# EAGLE design PISO3 (EAGLE 9.6.2)
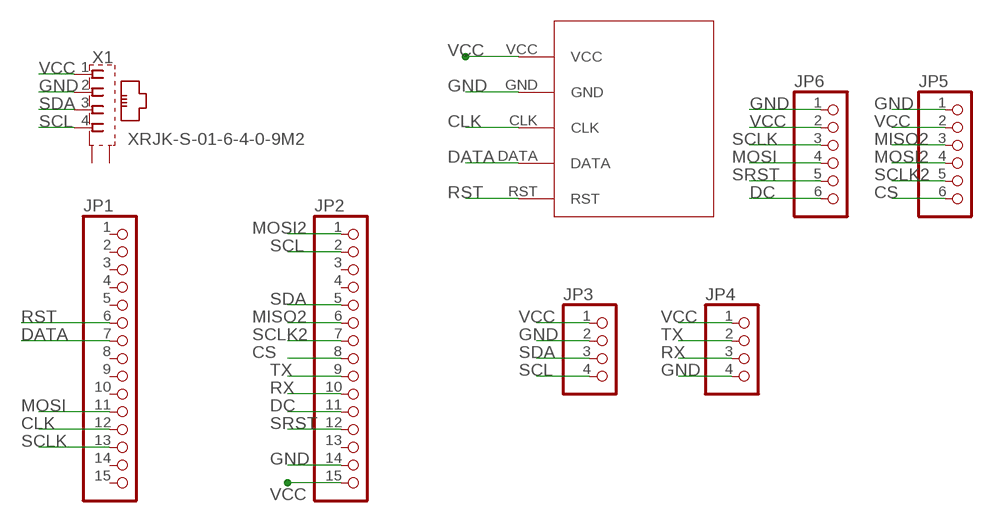
[diagram p0: schematic, sheet 1]

## Parts
JP1  PINHD-1X15  [1X15]
JP2  PINHD-1X15  [1X15]
JP3  PINHD-1X4  [1X04]
JP4  PINHD-1X4  [1X04]
JP5  PINHD-1X6  [1X06]
JP6  PINHD-1X6  [1X06]
U$1  DS1302_MODULE  [DS1307_MODULE]
X1  XRJK-S-01-6-4-0-9M2  [XRJK-S-01-6-4-0-9M2]

## Nets
CLK: JP1.12 U$1.CLK
CS: JP2.8 JP5.6
DATA: JP1.7 U$1.DATA
DC: JP2.11 JP6.6
GND: JP2.14 JP3.2 JP4.4 JP5.1 JP6.1 U$1.GND X1.2
MISO2: JP2.6 JP5.3
MOSI: JP1.11 JP6.4
MOSI2: JP2.1 JP5.4
RST: JP1.6 U$1.RST
RX: JP2.10 JP4.3
SCL: JP2.2 JP3.4 X1.4
SCLK: JP1.13 JP6.3
SCLK2: JP2.7 JP5.5
SDA: JP2.5 JP3.3 X1.3
SRST: JP2.12 JP6.5
TX: JP2.9 JP4.2
VCC: JP2.15 JP3.1 JP4.1 JP5.2 JP6.2 U$1.VCC X1.1
Unconnected: JP1.1 JP1.2 JP1.3 JP1.4 JP1.5 JP1.8 JP1.9 JP1.10 JP1.14 JP1.15 JP2.3 JP2.4 JP2.13 X1.S1(S) X1.S2(S)

## Library data of the parts
JP1 JP2 = pinhead:PINHD-1X15: PIN HEADER
JP3 JP4 = pinhead:PINHD-1X4: PIN HEADER
JP5 JP6 = pinhead:PINHD-1X6: PIN HEADER
U$1 = RTC1302:DS1302_MODULE: DS1302 MODULE
X1 = con-xmultiple:XRJK*4: RJ11 Connector without LED, 6 position, 4 contacts, thrue hole Source: XRJK-S-01-6-4-0-9M2(01).pdf

## Board
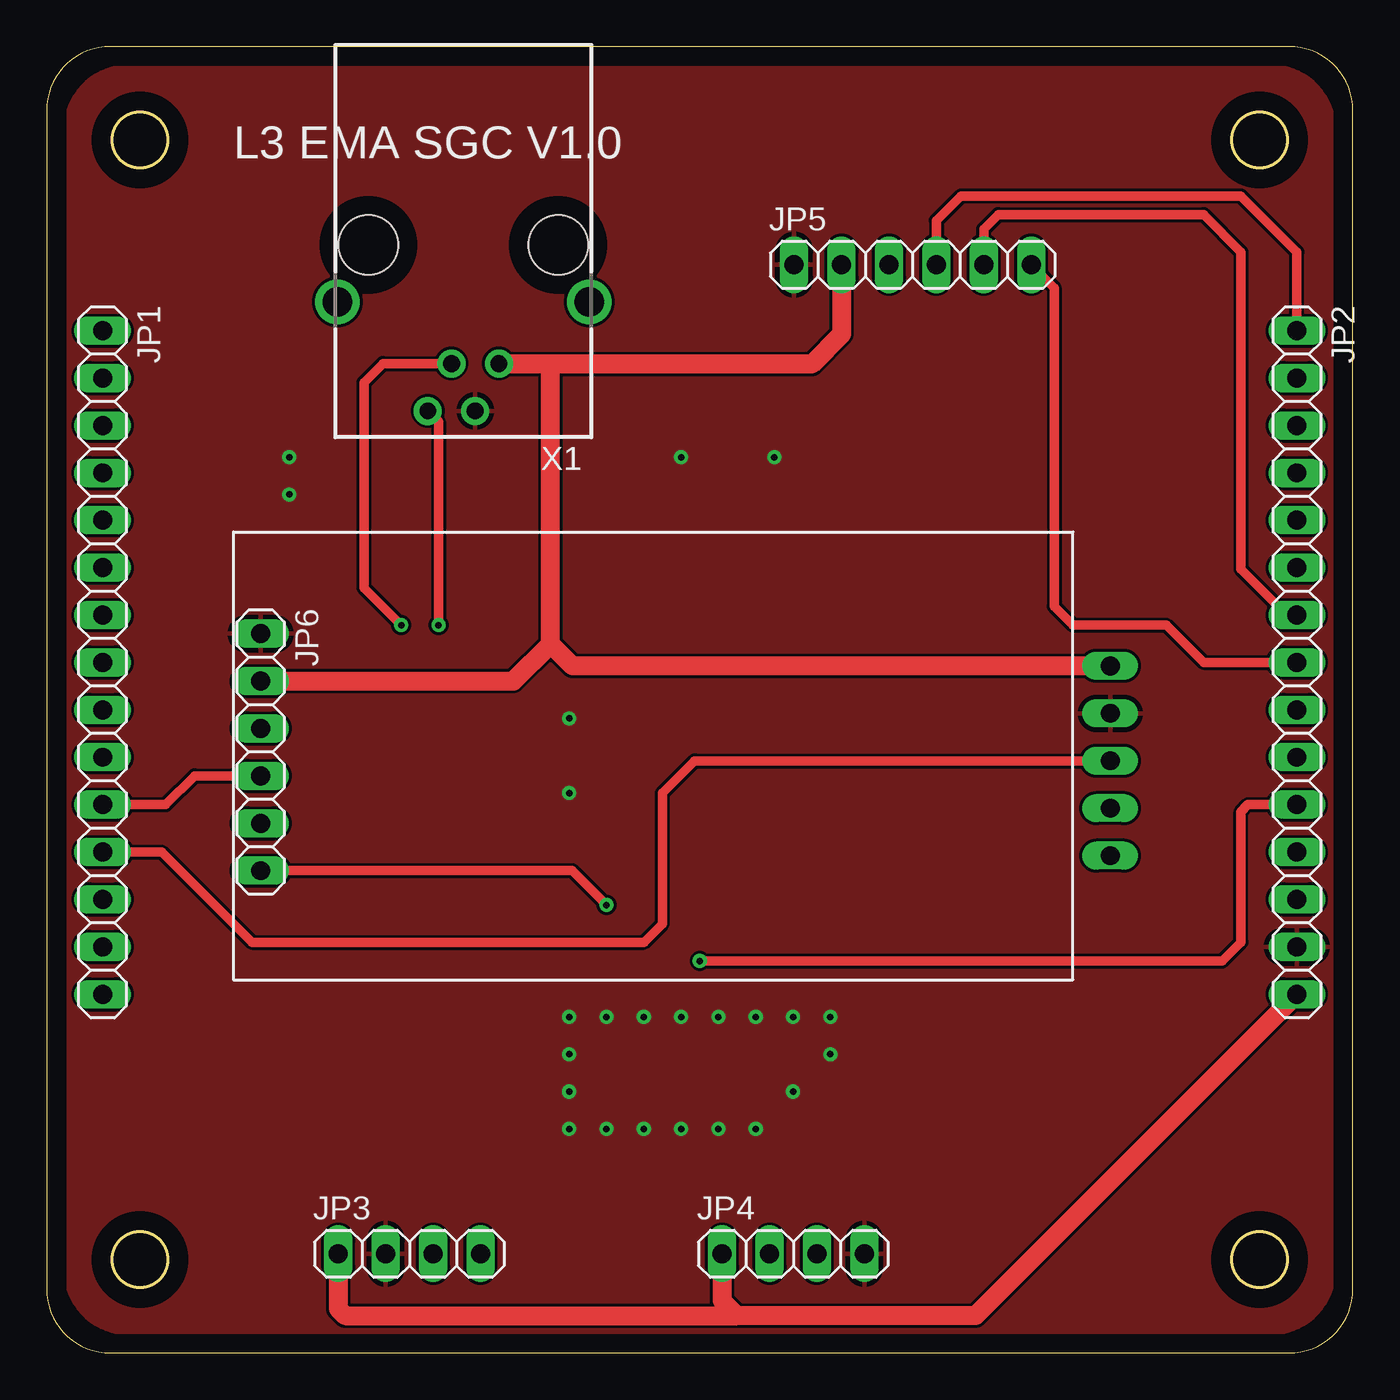
[diagram p1: board, top side]
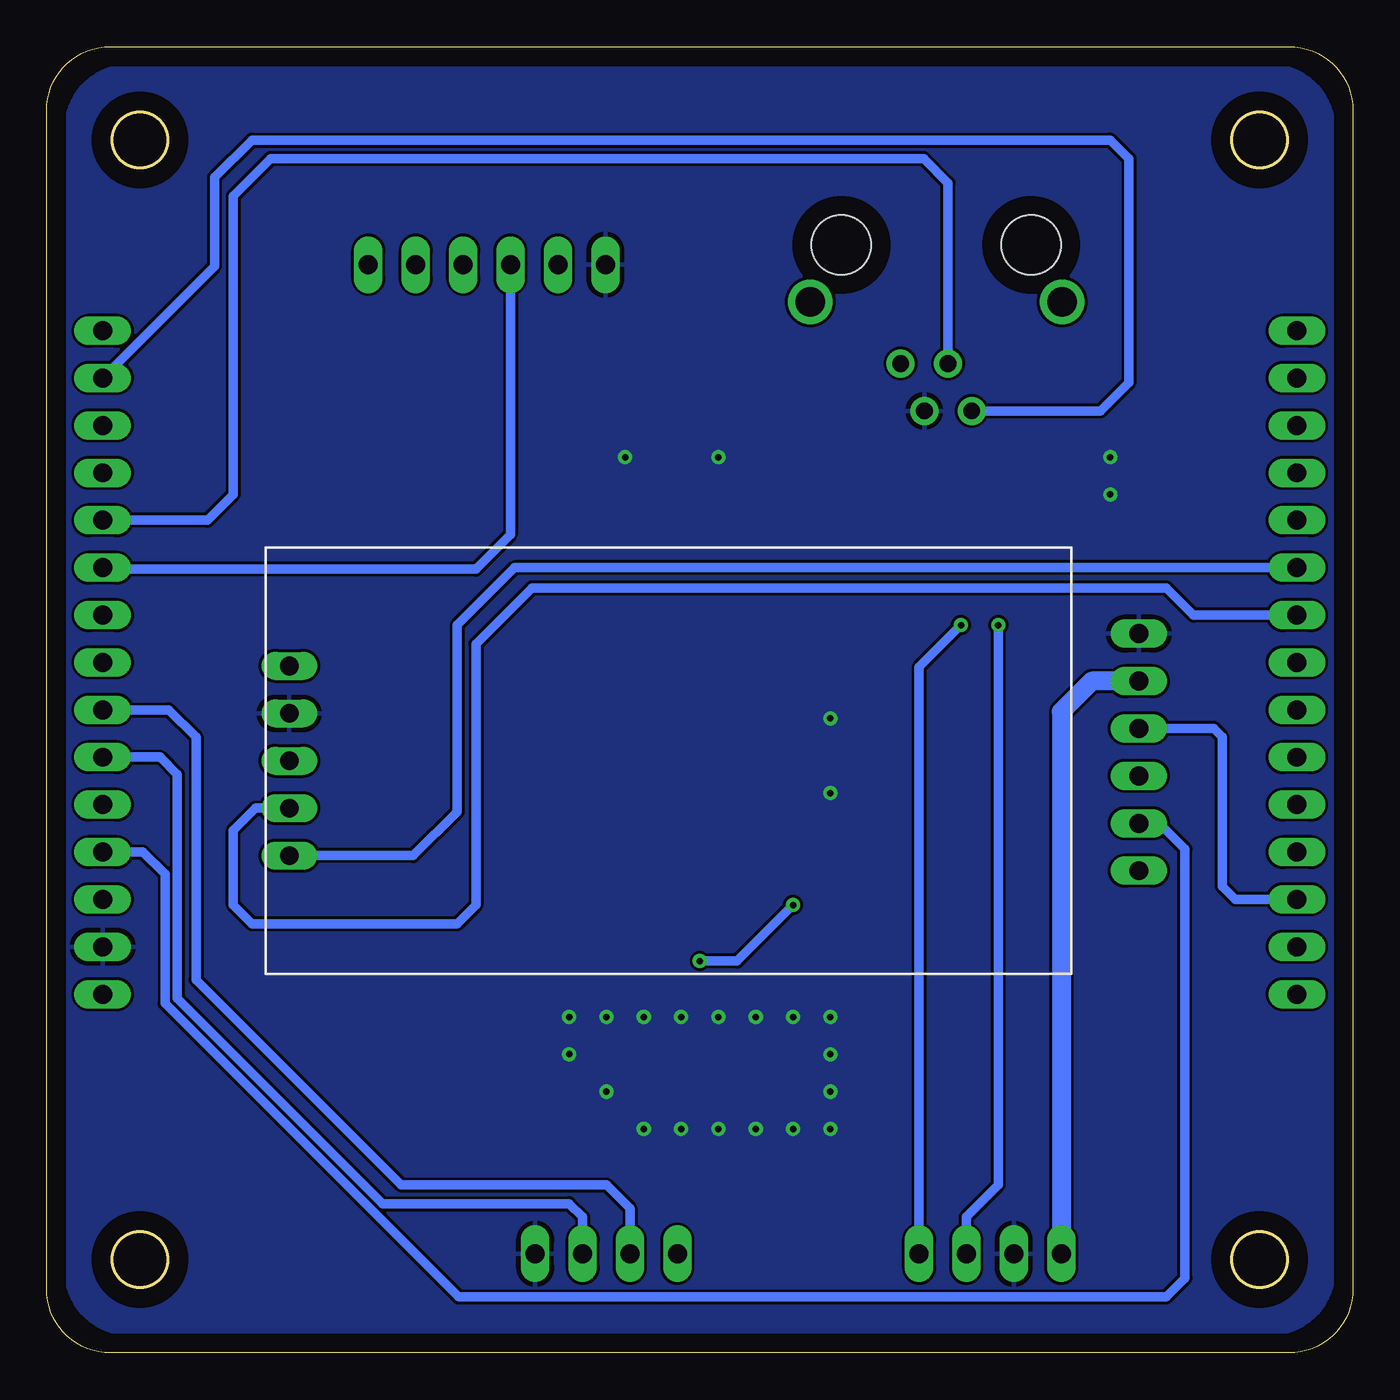
[diagram p2: board, bottom side, seen from below]

Size 70 x 70 mm. Coordinates in mm from the lower left corner, seen from the top.
Outline: 0,66.59 0,3.41 arc90 3.41,0 66.59,0 arc90 70,3.41 70,66.59 arc90 66.59,70 3.41,70 arc90 0,66.59
Outline: circle at 5,65 radius 1.5
Outline: circle at 65,65 radius 1.5
Outline: circle at 5,5 radius 1.5
Outline: circle at 65,5 radius 1.5
Copper layers (1*16): Top 0.035mm / dielectric 1.5mm / Bottom 0.035mm
Design rules "default": minimum track width 6mil, minimum drill 0.35mm, track to track 6mil, track to pad 6mil, pad to pad 6mil, via to via 6mil, smd to smd 6mil, copper to edge 40mil, drill to drill 6mil, minimum pad ring 10mil, minimum via ring 8mil, stop-mask expansion 4mil, vias tented up to drill 0mil, thermal gap 10mil

### Footprints (pad centres in the part's own frame; a part is rotated, then mirrored left to right if it is on the bottom)
1X15 = drill 1.016 long: 1 -17.78,0; 2 -15.24,0; 3 -12.7,0; 4 -10.16,0; 5 -7.62,0; 6 -5.08,0; 7 -2.54,0; 8 0,0; 9 2.54,0; 10 5.08,0; 11 7.62,0; 12 10.16,0; 13 12.7,0; 14 15.24,0; 15 17.78,0
1X04 = drill 1.016 long: 1 -3.81,0; 2 -1.27,0; 3 1.27,0; 4 3.81,0
1X06 = drill 1.016 long: 1 -6.35,0; 2 -3.81,0; 3 -1.27,0; 4 1.27,0; 5 3.81,0; 6 6.35,0
DS1307_MODULE = drill 1 long: CLK 0,-1.27; DATA 0,-3.81; GND 0,1.27; RST 0,-6.35; VCC 0,3.81
XRJK-S-01-6-4-0-9M2 = drill 0.9 pad 1.5: 1 -1.905,6.35; 2 -0.635,8.89; 3 0.635,6.35; 4 1.905,8.89 | drill 1.6 pad 2.184: S1 -6.75,3.05; S2 6.75,3.05 | hole 3.2: -5.08,0; 5.08,0

### Placement (x,y rotation side)
JP1  3,37 270 top
JP2  67,37 270 top
JP3  19.44,5.31 0 top
JP4  40.01,5.31 0 top
JP5  46.41,58.31 0 top
JP6  11.47,32.19 270 top
U$1  57,33 0 bottom
X1  22.33,59.37 180 top

### Tracks (layer width: path | path; a pad name or v marks a point on that pad's centre or on a via)
CLK
  Top 0.508: JP1.12 6.16,26.84 11,22 32,22 33,23 33,30 34.73,31.73 U$1.CLK
CS
  Top 0.508: JP5.6 54,57.07 54,40 55,39 60,39 62,37 JP2.8
DATA
  Bottom 0.508: JP1.7 8.54,39.54 10,41 44,41 47,38 47,24 48,23 59,23 60,24 60,28 58.81,29.19 U$1.DATA
DC  (via drill 0.35)
  Top 0.508: JP6.6 28.16,25.84 v30,24 | v35,21 63,21 64,22 64,29 64.38,29.38 JP2.11
  Bottom 0.508: v30,24 33,21 v35,21
GND  (via drill 0.35)
  other vias: 28,34 28,30 13,48 13,46 34,48 39,48 28,18 30,18 32,18 34,18 36,18 28,16 28,14 28,12 38,18 30,12 40,18 42,18 42,16 40,14 38,12 36,12 34,12 32,12
  pour Bottom: 65.59,1 4.41,1 arc-90 1,4.41 1,65.59 arc-90 4.41,69 65.59,69 arc-90 69,65.59 69,4.41 arc-90
  pour Top: 65.59,1 4.41,1 arc-90 1,4.41 1,65.59 arc-90 4.41,69 65.59,69 arc-90 69,65.59 69,4.41 arc-90
MISO2
  Bottom 0.508: JP5.3 45.14,43.86 47,42 66.92,42 JP2.6
MOSI
  Top 0.508: JP1.11 6.38,29.38 7.92,30.92 JP6.4
MOSI2
  Top 0.508: JP2.1 67,59 64,62 49,62 47.68,60.68 JP5.4
RST
  Bottom 0.508: U$1.RST 50.35,26.65 48,29 48,39 44.92,42.08 JP1.6
RX
  Bottom 0.508: JP2.10 63.92,31.92 63,31 63,19 52,8 42,8 41.28,7.28 JP4.3
SCL  (via drill 0.35)
  Top 0.508: X1.4 21,49.91 v21,39
  Bottom 0.508: JP2.2 61,58.24 61,63 59,65 13,65 12,64 12,52 13.52,50.48 X1.4 | v21,39 23.25,36.75 JP3.4
SCLK
  Bottom 0.508: JP1.13 6.3,24.3 7,25 7,33 7.46,33.46 JP6.3
SCLK2
  Top 0.508: JP5.5 50.22,60.22 51,61 62,61 64,59 64,42 66.46,39.54 JP2.7
SDA  (via drill 0.35)
  Top 0.508: v19,39 17,41 17,52 18.02,53.02 X1.3
  Bottom 0.508: X1.3 21.7,62.7 23,64 58,64 60,62 60,46 61.38,44.62 JP2.5 | JP3.3 20.71,7.29 19,9 v19,39
SRST
  Bottom 0.508: JP2.12 64.84,26.84 63.66,25.66 63.66,18.73 47.93,3 10,3 9,4 9,27 10.38,28.38 JP6.5
TX
  Bottom 0.508: JP2.9 63.46,34.46 62,33 62,20 51,9 40,9 38.74,7.74 JP4.2
VCC
  Top 1.016: JP2.15 49.78,2 37,2 | 36,5.11 JP4.1 36.2,2.8 37,2 | JP3.1 15.63,2.37 16,2 37,2 | JP5.2 42.6,54.6 41,53 27,53 | 27,53 24.25,53 X1.1 | JP6.2 25,36 27,38 | 27,38 27,53 | U$1.VCC 28.19,36.81 27,38
  Bottom 1.016: JP6.2 14,36 15.63,34.37 JP3.1

### Text on the board
tNames: L3 EMA SGC V1.0